# EAGLE schematic joysticks_keyboard (EAGLE 6.6.0)
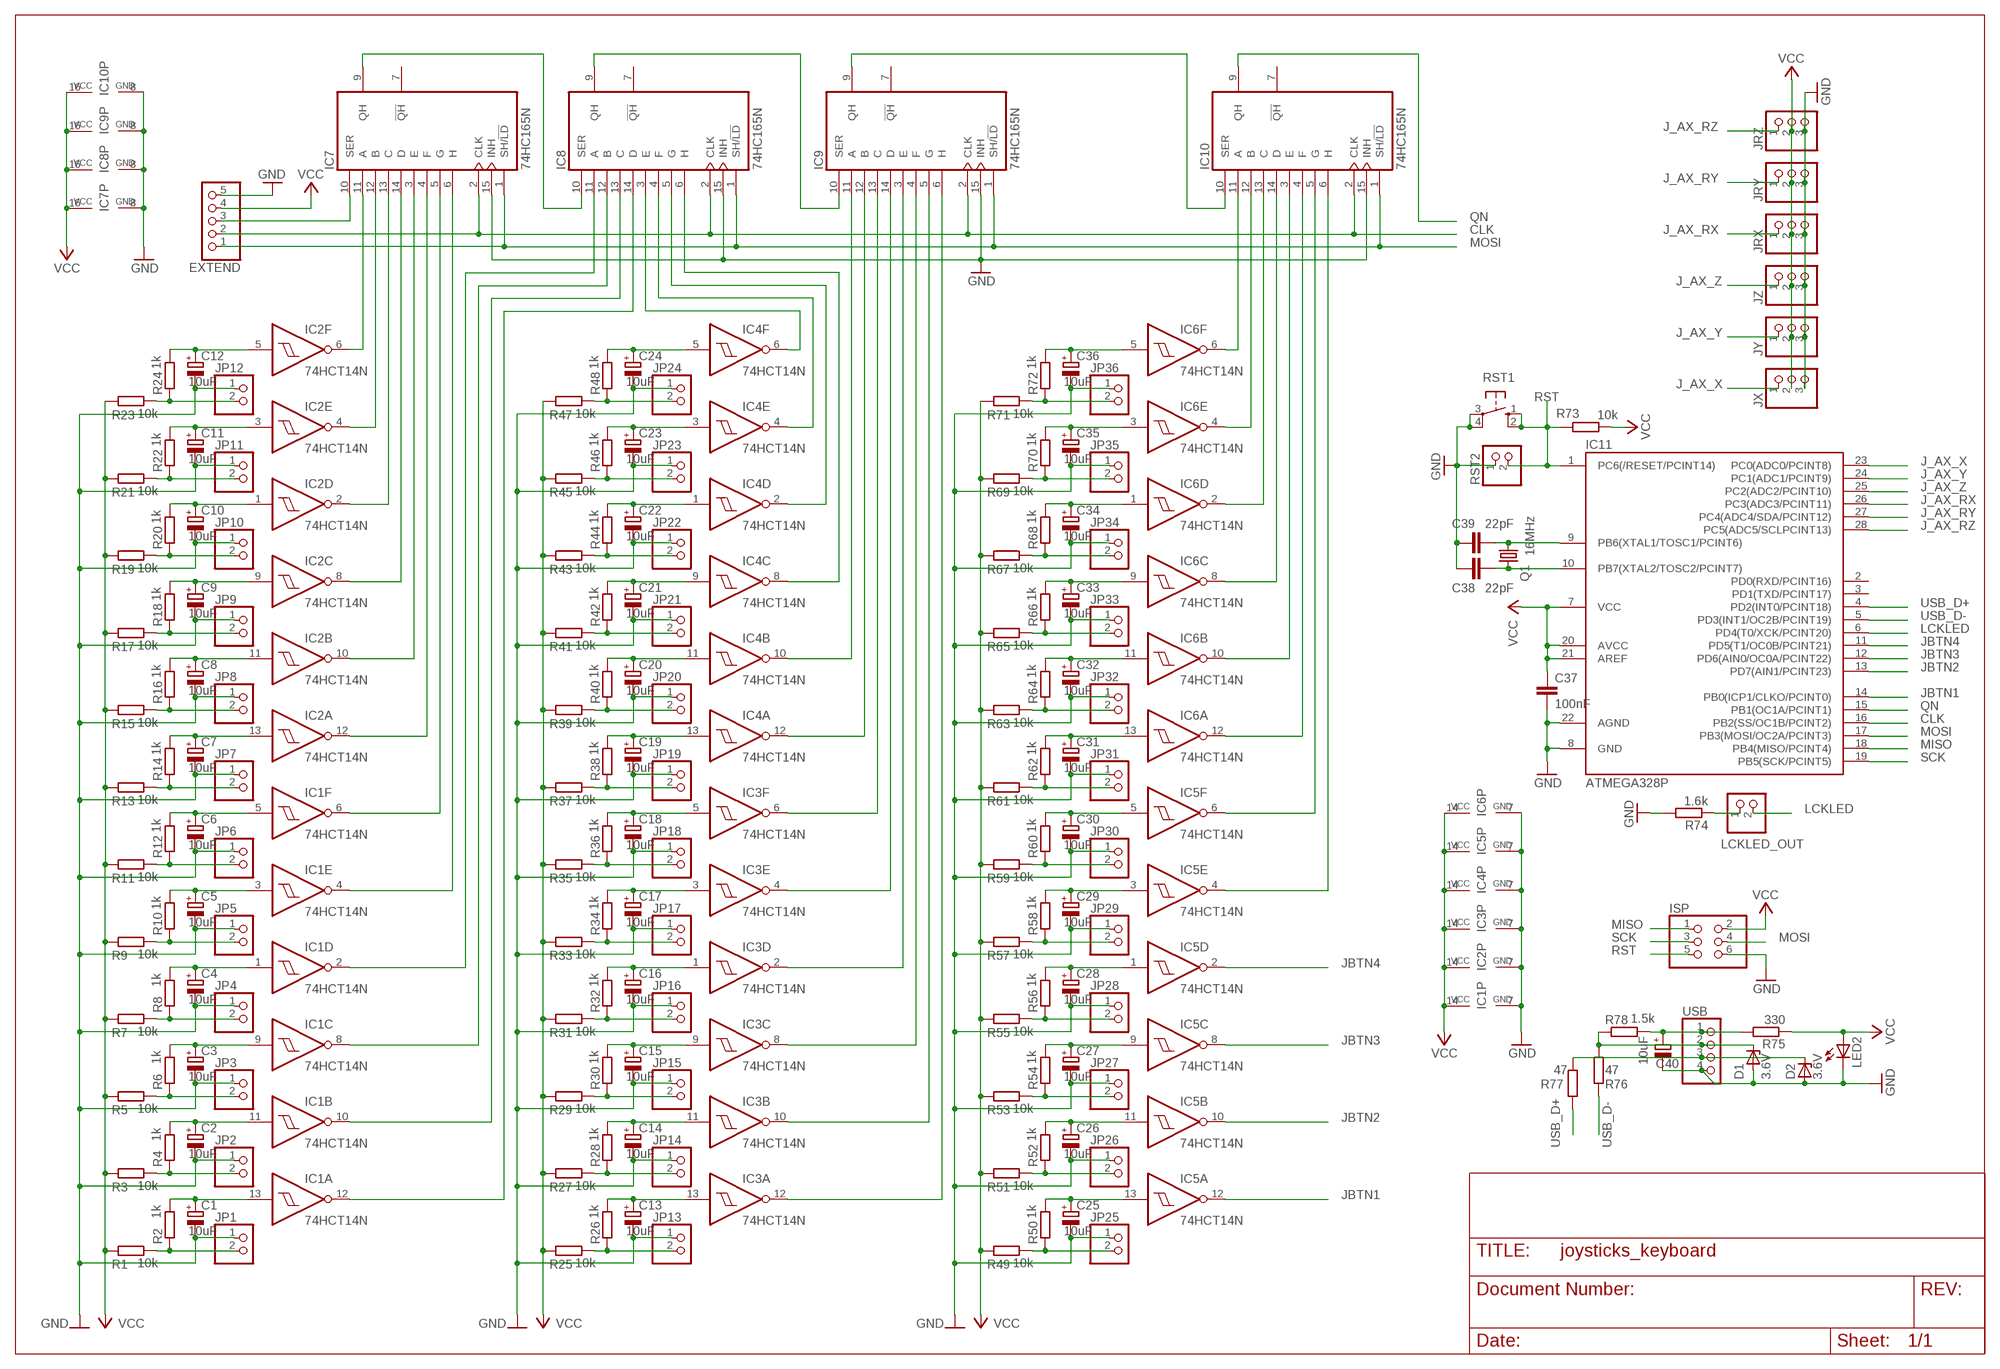
[diagram p0: schematic, sheet 1]

## Parts
C1  10uF  CPOL-EUE2-5  [E2-5]
C2  10uF  CPOL-EUE2-5  [E2-5]
C3  10uF  CPOL-EUE2-5  [E2-5]
C4  10uF  CPOL-EUE2-5  [E2-5]
C5  10uF  CPOL-EUE2-5  [E2-5]
C6  10uF  CPOL-EUE2-5  [E2-5]
C7  10uF  CPOL-EUE2-5  [E2-5]
C8  10uF  CPOL-EUE2-5  [E2-5]
C9  10uF  CPOL-EUE2-5  [E2-5]
C10  10uF  CPOL-EUE2-5  [E2-5]
C11  10uF  CPOL-EUE2-5  [E2-5]
C12  10uF  CPOL-EUE2-5  [E2-5]
C13  10uF  CPOL-EUE2-5  [E2-5]
C14  10uF  CPOL-EUE2-5  [E2-5]
C15  10uF  CPOL-EUE2-5  [E2-5]
C16  10uF  CPOL-EUE2-5  [E2-5]
C17  10uF  CPOL-EUE2-5  [E2-5]
C18  10uF  CPOL-EUE2-5  [E2-5]
C19  10uF  CPOL-EUE2-5  [E2-5]
C20  10uF  CPOL-EUE2-5  [E2-5]
C21  10uF  CPOL-EUE2-5  [E2-5]
C22  10uF  CPOL-EUE2-5  [E2-5]
C23  10uF  CPOL-EUE2-5  [E2-5]
C24  10uF  CPOL-EUE2-5  [E2-5]
C25  10uF  CPOL-EUE2-5  [E2-5]
C26  10uF  CPOL-EUE2-5  [E2-5]
C27  10uF  CPOL-EUE2-5  [E2-5]
C28  10uF  CPOL-EUE2-5  [E2-5]
C29  10uF  CPOL-EUE2-5  [E2-5]
C30  10uF  CPOL-EUE2-5  [E2-5]
C31  10uF  CPOL-EUE2-5  [E2-5]
C32  10uF  CPOL-EUE2-5  [E2-5]
C33  10uF  CPOL-EUE2-5  [E2-5]
C34  10uF  CPOL-EUE2-5  [E2-5]
C35  10uF  CPOL-EUE2-5  [E2-5]
C36  10uF  CPOL-EUE2-5  [E2-5]
C37  100nF  C-EU025-024X044  [C025-024X044]
C38  22pF  C-EU025-024X044  [C025-024X044]
C39  22pF  C-EU025-024X044  [C025-024X044]
C40  10uF  CPOL-EUE2,5-6E  [E2,5-6E]
D1  3.6V  ZENER-DIODEZD-2.5  [ZDIO-2.5]
D2  3.6V  ZENER-DIODEZD-2.5  [ZDIO-2.5]
EXTEND  PINHD-1X5  [1X05]
IC1  74HCT14N  [DIL14]
IC2  74HCT14N  [DIL14]
IC3  74HCT14N  [DIL14]
IC4  74HCT14N  [DIL14]
IC5  74HCT14N  [DIL14]
IC6  74HCT14N  [DIL14]
IC7  74HC165N  [DIL16]
IC8  74HC165N  [DIL16]
IC9  74HC165N  [DIL16]
IC10  74HC165N  [DIL16]
IC11  ATMEGA328P  MEGA48/88/168-PU  [DIL28-3]
ISP  PINHD-2X3  [2X03]
JP1  PINHD-1X2  [1X02]
JP2  PINHD-1X2  [1X02]
JP3  PINHD-1X2  [1X02]
JP4  PINHD-1X2  [1X02]
JP5  PINHD-1X2  [1X02]
JP6  PINHD-1X2  [1X02]
JP7  PINHD-1X2  [1X02]
JP8  PINHD-1X2  [1X02]
JP9  PINHD-1X2  [1X02]
JP10  PINHD-1X2  [1X02]
JP11  PINHD-1X2  [1X02]
JP12  PINHD-1X2  [1X02]
JP13  PINHD-1X2  [1X02]
JP14  PINHD-1X2  [1X02]
JP15  PINHD-1X2  [1X02]
JP16  PINHD-1X2  [1X02]
JP17  PINHD-1X2  [1X02]
JP18  PINHD-1X2  [1X02]
JP19  PINHD-1X2  [1X02]
JP20  PINHD-1X2  [1X02]
JP21  PINHD-1X2  [1X02]
JP22  PINHD-1X2  [1X02]
JP23  PINHD-1X2  [1X02]
JP24  PINHD-1X2  [1X02]
JP25  PINHD-1X2  [1X02]
JP26  PINHD-1X2  [1X02]
JP27  PINHD-1X2  [1X02]
JP28  PINHD-1X2  [1X02]
JP29  PINHD-1X2  [1X02]
JP30  PINHD-1X2  [1X02]
JP31  PINHD-1X2  [1X02]
JP32  PINHD-1X2  [1X02]
JP33  PINHD-1X2  [1X02]
JP34  PINHD-1X2  [1X02]
JP35  PINHD-1X2  [1X02]
JP36  PINHD-1X2  [1X02]
JRX  PINHD-1X3  [1X03]
JRY  PINHD-1X3  [1X03]
JRZ  PINHD-1X3  [1X03]
JX  PINHD-1X3  [1X03]
JY  PINHD-1X3  [1X03]
JZ  PINHD-1X3  [1X03]
LCKLED_OUT  PINHD-1X2  [1X02]
LED2  LEDLZR181  [LZR181]
Q1  16MHz  CRYSTALHC49S  [HC49/S]
R1  10k  R-EU_0204/2V  [0204V]
R2  1k  R-EU_0204/5  [0204/5]
R3  10k  R-EU_0204/2V  [0204V]
R4  1k  R-EU_0204/5  [0204/5]
R5  10k  R-EU_0204/2V  [0204V]
R6  1k  R-EU_0204/5  [0204/5]
R7  10k  R-EU_0204/2V  [0204V]
R8  1k  R-EU_0204/5  [0204/5]
R9  10k  R-EU_0204/2V  [0204V]
R10  1k  R-EU_0204/5  [0204/5]
R11  10k  R-EU_0204/2V  [0204V]
R12  1k  R-EU_0204/5  [0204/5]
R13  10k  R-EU_0204/2V  [0204V]
R14  1k  R-EU_0204/5  [0204/5]
R15  10k  R-EU_0204/2V  [0204V]
R16  1k  R-EU_0204/5  [0204/5]
R17  10k  R-EU_0204/2V  [0204V]
R18  1k  R-EU_0204/5  [0204/5]
R19  10k  R-EU_0204/2V  [0204V]
R20  1k  R-EU_0204/5  [0204/5]
R21  10k  R-EU_0204/2V  [0204V]
R22  1k  R-EU_0204/5  [0204/5]
R23  10k  R-EU_0204/2V  [0204V]
R24  1k  R-EU_0204/5  [0204/5]
R25  10k  R-EU_0204/2V  [0204V]
R26  1k  R-EU_0204/5  [0204/5]
R27  10k  R-EU_0204/2V  [0204V]
R28  1k  R-EU_0204/5  [0204/5]
R29  10k  R-EU_0204/2V  [0204V]
R30  1k  R-EU_0204/5  [0204/5]
R31  10k  R-EU_0204/2V  [0204V]
R32  1k  R-EU_0204/5  [0204/5]
R33  10k  R-EU_0204/2V  [0204V]
R34  1k  R-EU_0204/5  [0204/5]
R35  10k  R-EU_0204/2V  [0204V]
R36  1k  R-EU_0204/5  [0204/5]
R37  10k  R-EU_0204/2V  [0204V]
R38  1k  R-EU_0204/5  [0204/5]
R39  10k  R-EU_0204/2V  [0204V]
R40  1k  R-EU_0204/5  [0204/5]
R41  10k  R-EU_0204/2V  [0204V]
R42  1k  R-EU_0204/5  [0204/5]
R43  10k  R-EU_0204/2V  [0204V]
R44  1k  R-EU_0204/5  [0204/5]
R45  10k  R-EU_0204/2V  [0204V]
R46  1k  R-EU_0204/5  [0204/5]
R47  10k  R-EU_0204/2V  [0204V]
R48  1k  R-EU_0204/5  [0204/5]
R49  10k  R-EU_0204/2V  [0204V]
R50  1k  R-EU_0204/5  [0204/5]
R51  10k  R-EU_0204/2V  [0204V]
R52  1k  R-EU_0204/5  [0204/5]
R53  10k  R-EU_0204/2V  [0204V]
R54  1k  R-EU_0204/5  [0204/5]
R55  10k  R-EU_0204/2V  [0204V]
R56  1k  R-EU_0204/5  [0204/5]
R57  10k  R-EU_0204/2V  [0204V]
R58  1k  R-EU_0204/5  [0204/5]
R59  10k  R-EU_0204/2V  [0204V]
R60  1k  R-EU_0204/5  [0204/5]
R61  10k  R-EU_0204/2V  [0204V]
R62  1k  R-EU_0204/5  [0204/5]
R63  10k  R-EU_0204/2V  [0204V]
R64  1k  R-EU_0204/5  [0204/5]
R65  10k  R-EU_0204/2V  [0204V]
R66  1k  R-EU_0204/5  [0204/5]
R67  10k  R-EU_0204/2V  [0204V]
R68  1k  R-EU_0204/5  [0204/5]
R69  10k  R-EU_0204/2V  [0204V]
R70  1k  R-EU_0204/5  [0204/5]
R71  10k  R-EU_0204/2V  [0204V]
R72  1k  R-EU_0204/5  [0204/5]
R73  10k  R-EU_0204/7  [0204/7]
R74  1.6k  R-EU_0204/7  [0204/7]
R75  330  R-EU_0204/7  [0204/7]
R76  47  R-EU_0204/7  [0204/7]
R77  47  R-EU_0204/7  [0204/7]
R78  1.5k  R-EU_0204/7  [0204/7]
RST1  10-XX  [B3F-10XX]
RST2  PINHD-1X2  [1X02]
USB  PINHD-1X4  [1X04]

## Nets
CLK: EXTEND.2 IC7.2(CLK) IC8.2(CLK) IC9.2(CLK) IC10.2(CLK) IC11.16(PB2(SS/OC1B/PCINT2))
GND: C1.- C2.- C3.- C4.- C5.- C6.- C7.- C8.- C9.- C10.- C11.- C12.- C13.- C14.- C15.- C16.- C17.- C18.- C19.- C20.- C21.- C22.- C23.- C24.- C25.- C26.- C27.- C28.- C29.- C30.- C31.- C32.- C33.- C34.- C35.- C36.- C37.2 C38.1 C39.1 C40.- D1.A D2.A EXTEND.5 IC1.7(P:GND) IC2.7(P:GND) IC3.7(P:GND) IC4.7(P:GND) IC5.7(P:GND) IC6.7(P:GND) IC7.8(GND) IC7.15(INH) IC8.8(GND) IC8.15(INH) IC9.8(GND) IC9.15(INH) IC10.8(GND) IC10.15(INH) IC11.8(GND) IC11.22(AGND) ISP.6 JP1.1 JP2.1 JP3.1 JP4.1 JP5.1 JP6.1 JP7.1 JP8.1 JP9.1 JP10.1 JP11.1 JP12.1 JP13.1 JP14.1 JP15.1 JP16.1 JP17.1 JP18.1 JP19.1 JP20.1 JP21.1 JP22.1 JP23.1 JP24.1 JP25.1 JP26.1 JP27.1 JP28.1 JP29.1 JP30.1 JP31.1 JP32.1 JP33.1 JP34.1 JP35.1 JP36.1 JRX.3 JRY.3 JRZ.3 JX.3 JY.3 JZ.3 LED2.K(C) R74.2 RST1.3(P) RST1.4(P1) RST2.1 USB.4
J_AX_RX: IC11.26(PC3(ADC3/PCINT11)) JRX.1
J_AX_RY: IC11.27(PC4(ADC4/SDA/PCINT12)) JRY.1
J_AX_RZ: IC11.28(PC5(ADC5/SCLPCINT13)) JRZ.1
J_AX_X: IC11.23(PC0(ADC0/PCINT8)) JX.1
J_AX_Y: IC11.24(PC1(ADC1/PCINT9)) JY.1
J_AX_Z: IC11.25(PC2(ADC2/PCINT10)) JZ.1
JBTN1: IC5.12(A:O) IC11.14(PB0(ICP1/CLKO/PCINT0))
JBTN2: IC5.10(B:O) IC11.13(PD7(AIN1/PCINT23))
JBTN3: IC5.8(C:O) IC11.12(PD6(AIN0/OC0A/PCINT22))
JBTN4: IC5.2(D:O) IC11.11(PD5(T1/OC0B/PCINT21))
LCKLED: IC11.6(PD4(T0/XCK/PCINT20)) LCKLED_OUT.2
MISO: IC11.18(PB4(MISO/PCINT4)) ISP.1
MOSI: EXTEND.1 IC7.1(SH/!LD) IC8.1(SH/!LD) IC9.1(SH/!LD) IC10.1(SH/!LD) IC11.17(PB3(MOSI/OC2A/PCINT3)) ISP.4
N$1: JP1.2 R1.2 R2.1
N$2: JP9.2 R17.2 R18.1
N$3: C1.+ IC1.13(A:I) R2.2
N$4: JP2.2 R3.2 R4.1
N$5: C9.+ IC2.9(C:I) R18.2
N$6: C2.+ IC1.11(B:I) R4.2
N$7: JP3.2 R5.2 R6.1
N$8: JP10.2 R19.2 R20.1
N$9: C3.+ IC1.9(C:I) R6.2
N$10: JP4.2 R7.2 R8.1
N$11: C10.+ IC2.1(D:I) R20.2
N$12: C4.+ IC1.1(D:I) R8.2
N$13: JP5.2 R9.2 R10.1
N$14: JP11.2 R21.2 R22.1
N$15: C5.+ IC1.3(E:I) R10.2
N$16: JP6.2 R11.2 R12.1
N$17: C11.+ IC2.3(E:I) R22.2
N$18: C6.+ IC1.5(F:I) R12.2
N$19: JP7.2 R13.2 R14.1
N$20: JP12.2 R23.2 R24.1
N$21: C7.+ IC2.13(A:I) R14.2
N$22: JP8.2 R15.2 R16.1
N$23: C12.+ IC2.5(F:I) R24.2
N$24: C8.+ IC2.11(B:I) R16.2
N$25: JP13.2 R25.2 R26.1
N$26: C13.+ IC3.13(A:I) R26.2
N$27: JP14.2 R27.2 R28.1
N$28: C14.+ IC3.11(B:I) R28.2
N$29: JP15.2 R29.2 R30.1
N$30: C15.+ IC3.9(C:I) R30.2
N$31: JP16.2 R31.2 R32.1
N$32: C16.+ IC3.1(D:I) R32.2
N$33: JP17.2 R33.2 R34.1
N$34: C17.+ IC3.3(E:I) R34.2
N$35: JP18.2 R35.2 R36.1
N$36: C18.+ IC3.5(F:I) R36.2
N$37: JP19.2 R37.2 R38.1
N$38: C19.+ IC4.13(A:I) R38.2
N$39: JP20.2 R39.2 R40.1
N$40: C20.+ IC4.11(B:I) R40.2
N$41: JP21.2 R41.2 R42.1
N$42: C21.+ IC4.9(C:I) R42.2
N$43: JP22.2 R43.2 R44.1
N$44: C22.+ IC4.1(D:I) R44.2
N$45: JP23.2 R45.2 R46.1
N$46: C23.+ IC4.3(E:I) R46.2
N$47: JP24.2 R47.2 R48.1
N$48: C24.+ IC4.5(F:I) R48.2
N$49: JP25.2 R49.2 R50.1
N$50: C25.+ IC5.13(A:I) R50.2
N$51: JP26.2 R51.2 R52.1
N$52: C26.+ IC5.11(B:I) R52.2
N$53: JP27.2 R53.2 R54.1
N$54: C27.+ IC5.9(C:I) R54.2
N$55: JP28.2 R55.2 R56.1
N$56: C28.+ IC5.1(D:I) R56.2
N$57: JP29.2 R57.2 R58.1
N$58: C29.+ IC5.3(E:I) R58.2
N$59: JP30.2 R59.2 R60.1
N$60: C30.+ IC5.5(F:I) R60.2
N$61: JP31.2 R61.2 R62.1
N$62: C31.+ IC6.13(A:I) R62.2
N$63: JP32.2 R63.2 R64.1
N$64: C32.+ IC6.11(B:I) R64.2
N$65: JP33.2 R65.2 R66.1
N$66: C33.+ IC6.9(C:I) R66.2
N$67: JP34.2 R67.2 R68.1
N$68: C34.+ IC6.1(D:I) R68.2
N$69: JP35.2 R69.2 R70.1
N$70: C35.+ IC6.3(E:I) R70.2
N$71: JP36.2 R71.2 R72.1
N$72: C36.+ IC6.5(F:I) R72.2
N$73: IC2.6(F:O) IC7.11(A)
N$74: IC2.4(E:O) IC7.12(B)
N$75: IC2.2(D:O) IC7.13(C)
N$76: IC2.8(C:O) IC7.14(D)
N$77: IC2.10(B:O) IC7.3(E)
N$78: IC2.12(A:O) IC7.4(F)
N$79: IC1.6(F:O) IC7.5(G)
N$80: IC1.4(E:O) IC7.6(H)
N$81: IC1.2(D:O) IC8.11(A)
N$82: IC1.8(C:O) IC8.12(B)
N$83: IC1.10(B:O) IC8.13(C)
N$84: IC1.12(A:O) IC8.14(D)
N$85: IC4.6(F:O) IC8.3(E)
N$86: IC4.4(E:O) IC8.4(F)
N$87: IC4.2(D:O) IC8.5(G)
N$88: IC4.8(C:O) IC8.6(H)
N$89: IC4.10(B:O) IC9.11(A)
N$90: IC4.12(A:O) IC9.12(B)
N$91: IC3.6(F:O) IC9.13(C)
N$92: IC3.4(E:O) IC9.14(D)
N$93: IC3.2(D:O) IC9.3(E)
N$94: IC3.8(C:O) IC9.4(F)
N$95: IC3.10(B:O) IC9.5(G)
N$96: IC3.12(A:O) IC9.6(H)
N$97: IC6.6(F:O) IC10.11(A)
N$98: IC6.4(E:O) IC10.12(B)
N$99: IC6.2(D:O) IC10.13(C)
N$100: IC6.8(C:O) IC10.14(D)
N$101: IC6.10(B:O) IC10.3(E)
N$102: IC6.12(A:O) IC10.4(F)
N$103: IC5.6(F:O) IC10.5(G)
N$104: IC5.4(E:O) IC10.6(H)
N$105: IC7.9(QH) IC8.10(SER)
N$106: IC8.9(QH) IC9.10(SER)
N$107: IC9.9(QH) IC10.10(SER)
N$111: EXTEND.3 IC7.10(SER)
N$112: C40.+ R75.2 R78.2 USB.1
N$116: LCKLED_OUT.1 R74.1
N$117: C38.2 IC11.10(PB7(XTAL2/TOSC2/PCINT7)) Q1.1
N$118: C39.2 IC11.9(PB6(XTAL1/TOSC1/PCINT6)) Q1.2
N$121: D1.C R76.1 R78.1 USB.2
N$122: D2.C R77.1 USB.3
QN: IC10.9(QH) IC11.15(PB1(OC1A/PCINT1))
RST: IC11.1(PC6(/RESET/PCINT14)) ISP.5 R73.2 RST1.1(S) RST1.2(S1) RST2.2
SCK: IC11.19(PB5(SCK/PCINT5)) ISP.3
USB_D+: IC11.4(PD2(INT0/PCINT18)) R77.2
USB_D-: IC11.5(PD3(INT1/OC2B/PCINT19)) R76.2
VCC: C37.1 EXTEND.4 IC1.14(P:VCC) IC2.14(P:VCC) IC3.14(P:VCC) IC4.14(P:VCC) IC5.14(P:VCC) IC6.14(P:VCC) IC7.16(VCC) IC8.16(VCC) IC9.16(VCC) IC10.16(VCC) IC11.7(VCC) IC11.20(AVCC) IC11.21(AREF) ISP.2 JRX.2 JRY.2 JRZ.2 JX.2 JY.2 JZ.2 LED2.A R1.1 R3.1 R5.1 R7.1 R9.1 R11.1 R13.1 R15.1 R17.1 R19.1 R21.1 R23.1 R25.1 R27.1 R29.1 R31.1 R33.1 R35.1 R37.1 R39.1 R41.1 R43.1 R45.1 R47.1 R49.1 R51.1 R53.1 R55.1 R57.1 R59.1 R61.1 R63.1 R65.1 R67.1 R69.1 R71.1 R73.1 R75.1
Unconnected: IC7.7(!QH) IC8.7(!QH) IC9.7(!QH) IC10.7(!QH) IC11.2(PD0(RXD/PCINT16)) IC11.3(PD1(TXD/PCINT17))

## Library data of the parts
C1-C36 C40 = rcl:CPOL-EU: POLARIZED CAPACITOR, European symbol
C37-C39 = rcl:C-EU: CAPACITOR, European symbol
D1 D2 = diode:ZENER-DIODE: Z-Diode
EXTEND = pinhead:PINHD-1X5: PIN HEADER
IC1-IC6 = 74xx-eu:74*14: Hex schmitt trigger INVERTER
IC7-IC10 = 74xx-eu:74*165: 8-bit parallel load SHIFT REGISTER
IC11 = avr-6:MEGA48/88/168-PU
ISP = pinhead:PINHD-2X3: PIN HEADER
JP1-JP36 LCKLED_OUT RST2 = pinhead:PINHD-1X2: PIN HEADER
JRX JRY JRZ JX JY JZ = pinhead:PINHD-1X3: PIN HEADER
LED2 = led:LED: LED OSRAM: - CHIPLED LG R971, LG N971, LY N971, LG Q971, LY Q971, LO R971, LY R971 LH N974, LH R974 LS Q976, LO Q976, LY Q976 LO Q996 - Hyper CHIPLED LW Q18S LB Q993, LB Q99A, LB R99A - SideLED LS A670, LO A670, LY A670, LG A670, LP A670 LB A673, LV A673, LT A673, LW A673 LH A674 LY A675 LS A676, LA A676, LO A676, LY A676, LW A676 LS A679, LY A679, LG A679 - Hyper Micro SIDELED® LS Y876, LA Y876, LO Y876, LY Y876 LT Y87S - SmartLED LW L88C, LW L88S LB L89C, LB L89S, LG L890 LS L89K, LO L89K, LY L89K LS L896, LA L896, LO L896, LY L896 - TOPLED LS T670, LO T670, LY T670, LG T670, LP T670 LSG T670, LSP T670, LSY T670, LOP T670, LYG T670 LG T671, LOG T671, LSG T671 LB T673, LV T673, LT T673, LW T673 LH T674 LS T676, LA T676, LO T676, LY T676, LB T676, LH T676, LSB T676, LW T676 LB T67C, LV T67C, LT T67C, LS T67K, LO T67K, LY T67K, LW E67C LS E67B, LA E67B, LO E67B, LY E67B, LB E67C, LV E67C, LT E67C LW T67C LS T679, LY T679, LG T679 LS T770, LO T770, LY T770, LG T770, LP T770 LB T773, LV T773, LT T773, LW T773 LH T774 LS E675, LA E675, LY E675, LS T675 LS T776, LA T776, LO T776, LY T776, LB T776 LHGB T686 LT T68C, LB T68C - Hyper Mini TOPLED® LB M676 - Mini TOPLED Santana® LG M470 LS M47K, LO M47K, LY M47K Source: http://www.osram.convergy.de LUXEON: - LUMILED® LXK2-PW12-R00, LXK2-PW12-S00, LXK2-PW14-U00, LXK2-PW14-V00 LXK2-PM12-R00, LXK2-PM12-S00, LXK2-PM14-U00 LXK2-PE12-Q00, LXK2-PE12-R00, LXK2-PE12-S00, LXK2-PE14-T00, LXK2-PE14-U00 LXK2-PB12-K00, LXK2-PB12-L00, LXK2-PB12-M00, LXK2-PB14-N00, LXK2-PB14-P00, LXK2-PB14-Q00 LXK2-PR12-L00, LXK2-PR12-M00, LXK2-PR14-Q00, LXK2-PR14-R00 LXK2-PD12-Q00, LXK2-PD12-R00, LXK2-PD12-S00 LXK2-PH12-R00, LXK2-PH12-S00 LXK2-PL12-P00, LXK2-PL12-Q00, LXK2-PL12-R00 Source: www.luxeon.com KINGBRIGHT: KA-3528ASYC Source: www.kingbright.com
Q1 = crystal:CRYSTAL: CRYSTAL; OC_FARNELL: 1667008; OC_NEWARK: unknown
R1-R78 = rcl:R-EU_: RESISTOR, European symbol
RST1 = switch-omron:10-XX: OMRON SWITCH; MPN: B3F-1000; OC_FARNELL: 176432; OC_NEWARK: 36M3542
USB = pinhead:PINHD-1X4: PIN HEADER